# Altium schematic sheet Microcontroller_Power.SchDoc
size A4; SheetNumber: 5; SheetTotal: 8
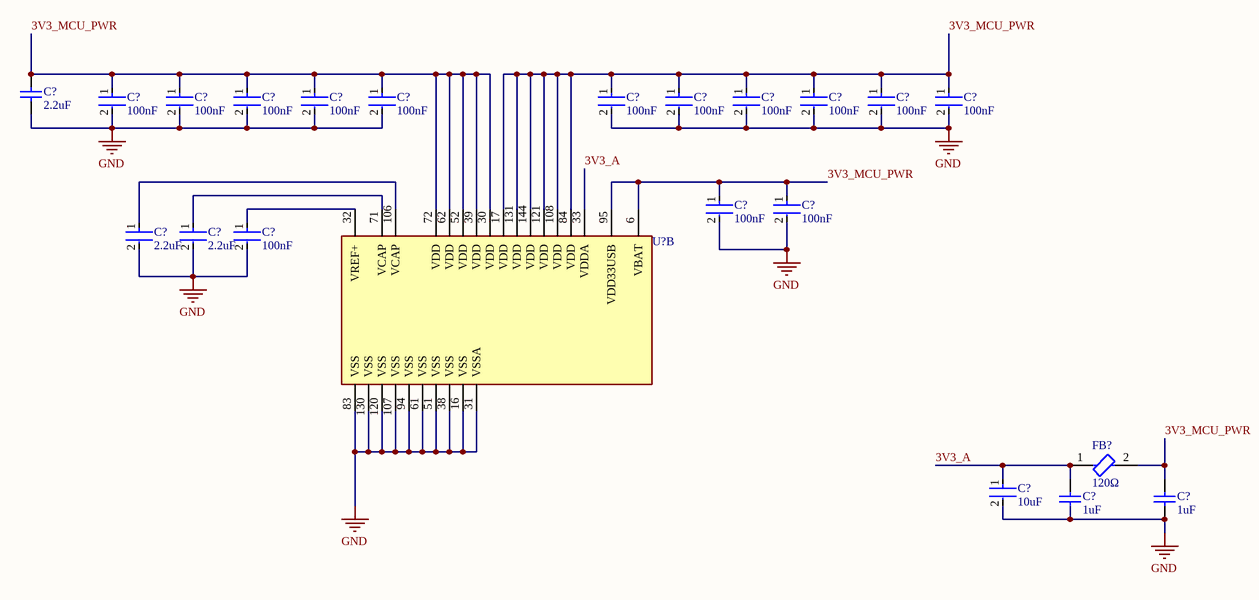
[diagram p0: Microcontroller_Power.SchDoc]

## Parts
(Parts that share a designator on the sheet are numbered #1, #2 ... from top to bottom, then left to right.)
C?#1  100nF  [FP-CGA3E-0_3-0_1-IPC_A]
C?#2  100nF  [FP-CGA3E-0_3-0_1-IPC_A]
C?#3  100nF  [FP-CGA3E-0_3-0_1-IPC_A]
C?#4  100nF  [FP-CGA3E-0_3-0_1-IPC_A]
C?#5  100nF  [FP-CGA3E-0_3-0_1-IPC_A]
C?#6  100nF  [FP-CGA3E-0_3-0_1-IPC_A]
C?#7  100nF  [FP-CGA3E-0_3-0_1-IPC_A]
C?#8  100nF  [FP-CGA3E-0_3-0_1-IPC_A]
C?#9  100nF  [FP-CGA3E-0_3-0_1-IPC_A]
C?#10  100nF  [FP-CGA3E-0_3-0_1-IPC_A]
C?#11  100nF  [FP-CGA3E-0_3-0_1-IPC_A]
C?#12  2.2uF  [CAPC2013X145X50ML20T25]
C?#13  100nF  [FP-CGA3E-0_3-0_1-IPC_A]
C?#14  100nF  [FP-CGA3E-0_3-0_1-IPC_A]
C?#15  2.2uF  [FP-GRM188-0_1-e0_2_0_5-MFG]
C?#16  2.2uF  [FP-GRM188-0_1-e0_2_0_5-MFG]
C?#17  100nF  [FP-CGA3E-0_3-0_1-IPC_A]
C?#18  10uF  [FP-GRM188-0_1-e0_2_0_55-IPC_A]
C?#19  1uF  [CAPC1608X87X35LL15T15]
C?#20  1uF  [CAPC1608X87X35LL15T15]
FB?  120Ω  [FP-BLM21-0_2-t0_85-e0_5-IPC_A]
U?  (no value)  [FP-LQFP144-1A-MFG]  (part B of 3)

## Nets
GND: C?#1.2 C?#2.2 C?#3.2 C?#4.2 C?#5.2 C?#6.2 C?#7.2 C?#8.2 C?#9.2 C?#10.2 C?#11.2 C?#12.1 C?#13.2 C?#14.2 C?#15.2 C?#16.2 C?#17.2 C?#18.2 C?#19.1 C?#20.1 U?.16(VSS) U?.31(VSSA) U?.38(VSS) U?.51(VSS) U?.61(VSS) U?.83(VSS) U?.94(VSS) U?.107(VSS) U?.120(VSS) U?.130(VSS)
3V3_A: C?#18.1 C?#19.2 FB?.1 U?.33(VDDA)
3V3_MCU_PWR: C?#1.1 C?#2.1 C?#3.1 C?#4.1 C?#5.1 C?#6.1 C?#7.1 C?#8.1 C?#9.1 C?#10.1 C?#11.1 C?#12.2 C?#13.1 C?#14.1 C?#20.2 FB?.2 U?.6(VBAT) U?.17(VDD) U?.30(VDD) U?.39(VDD) U?.52(VDD) U?.62(VDD) U?.72(VDD) U?.84(VDD) U?.95(VDD33USB) U?.108(VDD) U?.121(VDD) U?.131(VDD) U?.144(VDD)
NetC?#15_1: C?#15.1 U?.106(VCAP)
NetC?#16_1: C?#16.1 U?.71(VCAP)
NetC?#17_1: C?#17.1 U?.32(VREF+)

## Library data of the parts
C?#1-C?#11 C?#13 C?#14 C?#17 = CMP-2000-07546-2: Cap Ceramic 100nF 50V X7R 10% Pad SMD 0603 +125°C Automotive T/R; Weight: 7.1E-05oz; Composition: Ceramic; Max Operating Temperature: 125°C; Termination: SMD/SMT; Dielectric: X7R; Length: 1.6mm; Package Quantity: 1; REACH SVHC: No SVHC; Lead Free: Lead Free; Case Code (Metric): 1608; Min Operating Temperature: -55°C; Packaging: Tape and Reel; Tolerance: 10%; Voltage Rating: 50V; Case Code (Imperial): 0603; Capacitance: 100nF; Case/Package: 0603; Voltage Rating (DC): 50V; Depth: 0.8mm; Radiation Hardening: No; Ratings: AEC-Q200; Mount: Surface Mount; Voltage: 50V; Thickness: 0.035inch; Width: 0.8mm; Height: 0.8mm
C?#12 = CMP-1036-04819-2: Part Number: C0805C225K9PACTU; Manufacturer: Kemet
C?#15 C?#16 = CMP-2006-02836-2: Chip Multilayer Ceramic Capacitors for General Purpose, 0603, 2.2uF, X7R, 15%, 10%, 10V; Case Code (Metric): 1608; Height: 0.8mm; Packaging: Cut Tape; Voltage: 10V; Lead Free: Lead Free; Min Operating Temperature: -55°C; Voltage Rating (DC): 10V; Max Operating Temperature: 125°C; Voltage Rating: 10V; Dielectric: X7R; Depth: 0.8mm; Case Code (Imperial): 0603; Termination: SMD/SMT; Case/Package: 0603; Number of Pins: 2; REACH SVHC: No SVHC; Mount: Surface Mount; Width: 0.031inch; Material: Ceramic; Capacitance: 2.2uF; Package Quantity: 1; Weight: 7.1E-05oz; Length: 1.6mm; Thickness: 0.035inch; Tolerance: 10%
C?#18 = CMP-2006-02792-2: Chip Multilayer Ceramic Capacitors for General Purpose, 0603, 10uF, X5R, 15%, 20%, 6.3V; Packaging: Tape and Reel; Voltage Rating (DC): 6.3V; Width: 0.031inch; Termination: SMD/SMT; Dielectric: X5R; Package Quantity: 4000; Voltage Rating: 6.3V; Capacitance: 10uF; Case/Package: 0603; Min Operating Temperature: -55°C; Voltage: 6.3V; Length: 1.6mm; Thickness: 0.035inch; Lead Free: Lead Free; Depth: 0.8mm; Case Code (Imperial): 0603; Max Operating Temperature: 85°C; Material: Ceramic; Height: 0.8mm; Tolerance: 20%; Mount: Surface Mount; REACH SVHC: No SVHC; Radiation Hardening: No; Case Code (Metric): 1608
C?#19 C?#20 = CMP-2006-03713-1: Part Number: C0603C105K3RACTU; Manufacturer: Kemet
FB? = CMP-0686-00716-3: FERRITE BEAD 120 OHM 0805 1LN; Number of Lines: 1; DC Resistance-Max: 100mR; Material: Steel; Max DC Current: 200mA; Shielding: Unshielded; Test Frequency: 100MHz; Impedance: 120R; Current Rating: 800mA; Max Current Rating: 1A; Resistance: 150mR; Tolerance: 25%; Width: 1.25mm; Number of Circuits: 1; Military Standard: Not; Height: 0.85mm; Series: BLM21A; Min Operating Temperature: -55°C; DC Resistance (DCR): 100mR; Termination: SMD/SMT; Core Material: Ferrite; REACH SVHC: No SVHC; Radiation Hardening: No; Max Operating Temperature: 125°C; Number of Pins: 2; Case/Package: 0805; Case Code (Imperial): 0805; Frequency: 100MHz; Depth: 1.25mm; Length: 2mm; DC Current: 200mA; Lead Free: Lead Free; Case Code (Metric): 2012; Package Quantity: 1; Packaging: Tape and Reel
U? = CMP-12105-000009-1: LQFP 144 20X20X1.4 2; Manufacturer: STMicroelectronics; Manufacturer Part Number: STM32H753ZIT6; Number Of Pwm Channels: 24; Number Of I/Os: 114; Number Of Cores: 1; Min Supply Voltage: 1.62V; Interface: I2C,SPI,UART,USART,CAN,USB,LIN,IrDA,Ethernet,I2S,SMBus,Other; Standoff Height: 0.05mm; Number Of I2C Channels: 4; Max Junction Temp: +125°C; Memory Type: FLASH; Ram Size: 1MBytes; Number Of Spi Channels: 6; Core Architecture: ARM Cortex-M7; Number Of Uart Channels: 9; Memory Size: 2MBytes; Number Of Adc Channels: 36; Frequency: 480MHz; Data Bus Width: 32bits; Max Supply Voltage: 3.6V; Number Of Usb Channels: 2; Number Of A/D Converters: 3; Number Of Timers/Counters: 20; Temperature Range High: +125°C; Automotive: No; Mouser Description: MCU 32-Bit STM32 ARM Cortex M7 RISC 2MB Flash 1.8V/2.5V/3.3V 144-Pin LQFP Tray; Device Class L3: Microcontrollers; Height: 1.6mm; Octopart: https://octopart.com/stm32h753zit6-stmicroelectronics-87879771; Device Class L2: Embedded Processors and Controllers; Lead Free: Yes; Category: IC; ComponentLink2URL: https://www.st.com/resource/en/datasheet/stm32h753zi.pdf; Ambient Temperature Range High: +85°C; Number Of Ethernet Channels: 1; Device Class L1: Integrated Circuits (ICs); Ambient Temperature Range Low: -40°C; Package: LQFP144-1A; Temperature Range Low: -40°C; Digikey Description: LQFP 144 20X20X1.4 2; ComponentLink2Description: Datasheet; Temperature: -40°C to +125°C; RoHS: TRUE